# Altium schematic sheet Hardware.SchDoc
size A4; DocumentNumber: 10; SheetNumber: 10; SheetTotal: 11
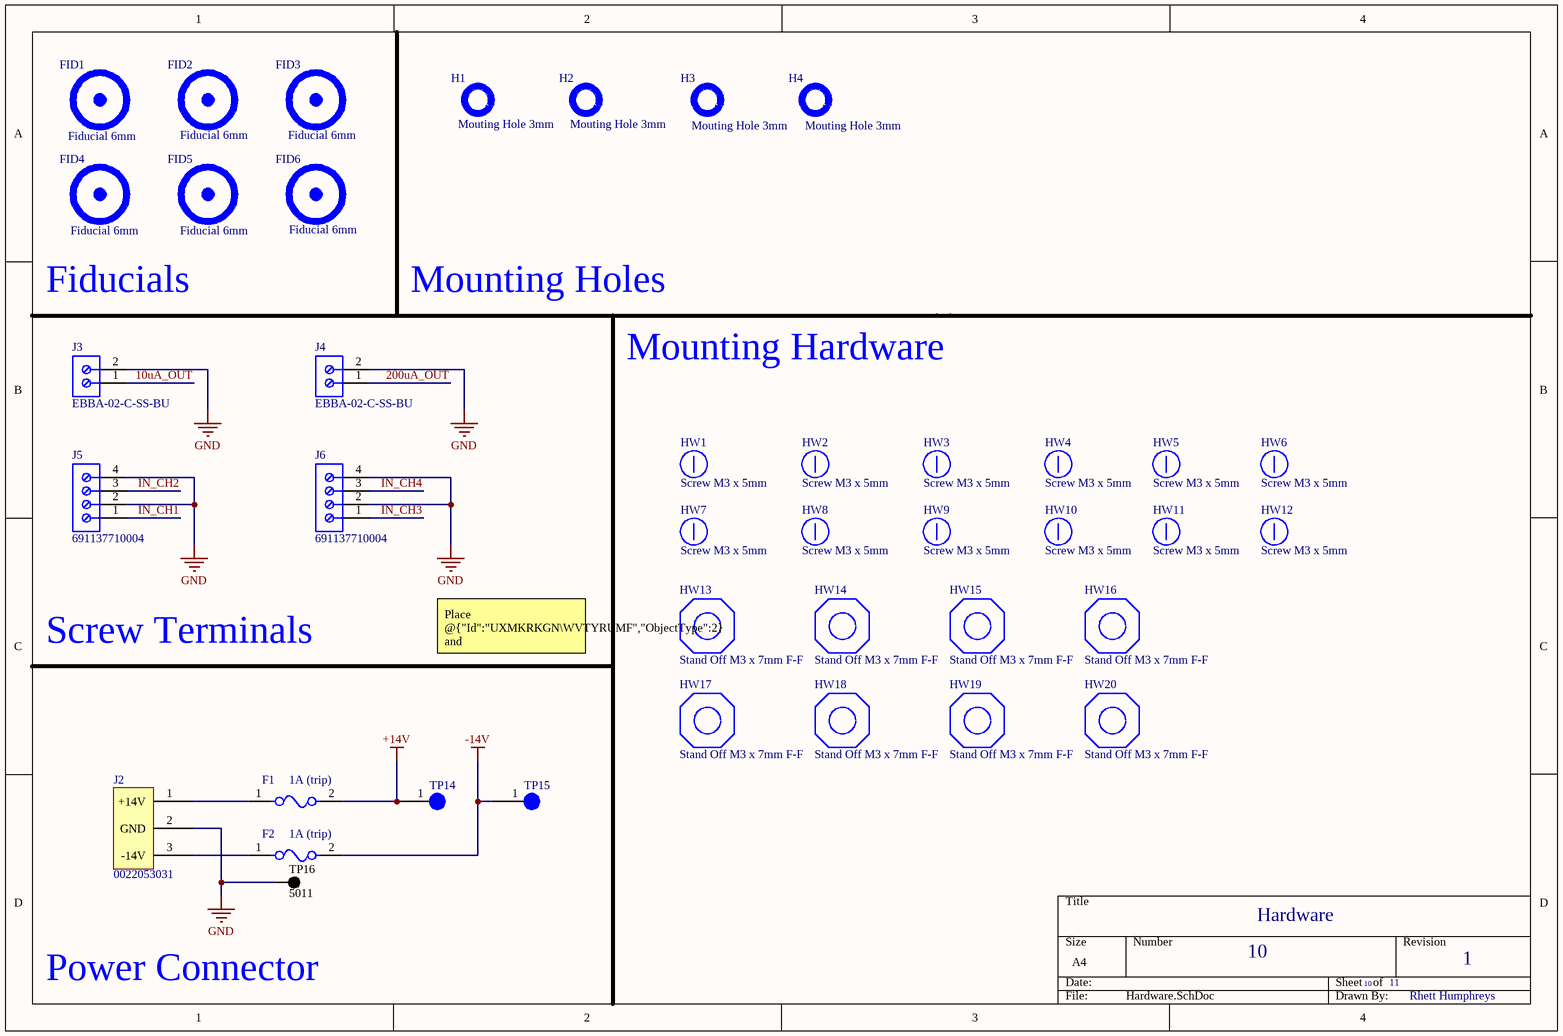
[diagram p0: Hardware.SchDoc]

## Parts
F1  1A (trip)  [FP-0466-MFG]
F2  1A (trip)  [FP-0466-MFG]
FID1  Fiducial 6mm  [Fiducial 6mm]
FID2  Fiducial 6mm  [Fiducial 6mm]
FID3  Fiducial 6mm  [Fiducial 6mm]
FID4  Fiducial 6mm  [Fiducial 6mm]
FID5  Fiducial 6mm  [Fiducial 6mm]
FID6  Fiducial 6mm  [Fiducial 6mm]
H1  Mouting Hole 3mm  [MH3]
H2  Mouting Hole 3mm  [MH3]
H3  Mouting Hole 3mm  [MH3]
H4  Mouting Hole 3mm  [MH3]
HW1  Screw M3 x 5mm
HW2  Screw M3 x 5mm
HW3  Screw M3 x 5mm
HW4  Screw M3 x 5mm
HW5  Screw M3 x 5mm
HW6  Screw M3 x 5mm
HW7  Screw M3 x 5mm
HW8  Screw M3 x 5mm
HW9  Screw M3 x 5mm
HW10  Screw M3 x 5mm
HW11  Screw M3 x 5mm
HW12  Screw M3 x 5mm
HW13  Stand Off M3 x 7mm F-F
HW14  Stand Off M3 x 7mm F-F
HW15  Stand Off M3 x 7mm F-F
HW16  Stand Off M3 x 7mm F-F
HW17  Stand Off M3 x 7mm F-F
HW18  Stand Off M3 x 7mm F-F
HW19  Stand Off M3 x 7mm F-F
HW20  Stand Off M3 x 7mm F-F
J2  0022053031  [0022053031]
J3  EBBA-02-C-SS-BU  [TECO-282836-2_V]
J4  EBBA-02-C-SS-BU  [TECO-282836-2_V]
J5  691137710004  [691137710004]
J6  691137710004  [691137710004]
TP14  Test-Point 3mm  [TestPoint 3mm]  (value not drawn)
TP15  Test-Point 3mm  [TestPoint 3mm]  (value not drawn)
TP16  5011  [KSTN-5011_V]

## Nets
+14V: F1.2 TP14.1
-14V: F2.2 TP15.1
GND: J2.2(GND) J3.2 J4.2 J5.2 J5.4 J6.2 J6.4 TP16.1
10uA_OUT: J3.1
200uA_OUT: J4.1
IN_CH1: J5.1
IN_CH2: J5.3
IN_CH3: J6.1
IN_CH4: J6.3
NetF1_1: F1.1 J2.1(+14V)
NetF2_1: F2.1 J2.3(-14V)

## Notes on the sheet
- Fiducials
- Mounting Holes
- Mounting Hardware
- Screw Terminals
- Place @{"Id":"UXMKRKGN\WVTYRUMF","ObjectType":2} and @{"Id":"UXMKRKGN\KFKNCMDB","ObjectType":2} relatively close to @{"Id":"UXMKRKGN\FYZIDNJZ","ObjectType":2} and @{"Id":"UXMKRKGN\LLHQVDIL","ObjectType":2}.
- Hardware
- Power Connector
- 10
- 11
- 1
- Rhett Humphreys

## Library data of the parts
F1 F2 = CMP-08605-000058-1: FUSE BOARD MNT 1A 63VAC/VDC 1206; Manufacturer Part Number: 0466001.NR; Manufacturer: Littelfuse Inc; Max Fuse Dc Voltage: 63V; Fuse Interrupt Ac Current: 50A; Fuse Voltage Drop: 79.97mV; Resistance: 0.075Ω; Value: 0.075Ω; Fuse I2T: 0.0423A2Sec; Fuse Blow Speed: Fast; Temperature Range High: +90°C; Max Fuse Ac Voltage: 63V; Package: 0466; ComponentLink2URL: https://www.littelfuse.com/~/media/electronics/datasheets/fuses/littelfuse_fuse_466_datasheet.pdf.pdf; Device Class L3: unset; Lead Free: Yes; Automotive: No; Digikey Description: FUSE BOARD MNT 1A 63VAC/VDC 1206; Height: 0.66mm; Temperature Range Low: -55°C; Category: Fuse; ComponentLink2Description: Datasheet; Device Class L1: Circuit Protection; Device Class L2: Fuses; Fuse Current: 1A; Mouser Description: Surface Mount Fuses 63V FA 1206 1A VFA Slimline; Octopart: https://octopart.com/0466001.nr-littelfuse-566005; Fuse Interrupt Dc Current: 50A; RoHS: TRUE; Voltage Rating: 63V; Temperature: -55°C to +90°C
H1-H4 = MH3
HW1-HW12 = Screw M3 x 5mm: Fastener flathead M3 x 5mm
HW13-HW20 = Stand Off M3 x 7mm F-F: Stand off hex M3 x 7mm
J3 J4 = CMP-1684-00017-1: Female Header, Pitch 5 mm, 1 x 2 Position, Height 10 mm, Tail Length 3.5 mm, Rohs, Bulk; Manufacturer: TE Connectivity; Wire Gauge: 16-30AWG; Product Training Modules: Wire-to-BoardEurostyleTerminalBlocks; Clamp Material - Plating: Brass-NickelPlated; Voltage: 300V; Mating Orientation: HorizontalwithBoard; Current: 13.5A; Pitch: 0.197"(5.00mm); Screw Thread: M3; 3D Model: 282836-2.pdf; Other Names: 5ULV-02B / A98076; Dynamic Catalog: BuchananSeries; Number of Levels: 1; Torque - Screw: 0.68Nm(6Lb-In); Featured Product: EurostyleTerminalBlockConnectors; Positions Per Level: 2; Wire Termination: Screw-RisingCageClamp; Datasheet URL: http://www.te.com.cn/commerce/DocumentDelivery/DDEController?Action=showdoc&DocId=Catalog+Section%7F1308389_EUROSTYLE_TERMINAL_BLOCKS%7F0607%7Fpdf%7FEnglish%7FENG_CS_1308389_EUROSTYLE_TERMINAL_BLOCKS_0607.pdf%7F282836-2; Color: Green; Family: TerminalBlocks-WiretoBoard; RoHS Information: 282836-2StatementofCompliance; Standard Package: 300; Contact Material - Plating: Brass-TinPlated; Manufacturer URL: http://www.te.com; Housing Material: Polyamide(PA66),Nylon6/6; Features: Interlocking(Side); Package Description: Female Header, Pitch 5 mm, 1 x 2 Position, Height 10 mm, Tail Length 3.5 mm; Mounting Type: ThroughHole; Package Reference: THD; Packaging: Bulk; Series: Buchanan; Category: Connectors,Interconnects; Screw Material - Plating: Brass-NickelPlated
J5 J6 = CMP-1502-03326-2: NexarPartId: 78871140; Packaging: Box; RoHS: Non-Compliant; Number of Pins: 4; Lead Pitch: 5mm
TP16 = CMP-1672-00003-4: Test Point, Black, Through Hole, RoHS, Bulk; Manufacturer: Keystone; ComponentLink2URL: http://www.keyelco.com/product-pdf.cfm?p=1320; Colour: Black; Pins: 1; REACH SVHC: No SVHC; ComponentLink1URL: http://www.keyelco.com/; PackageReference: 5011; Contact Plating: Silver; Package Quantity: 100; Packaging: Bulk; RoHSCompliant: true; Height: 8.12 mm; PackageDescription: 1-Pin Through Hole Device, Dia 3.17 mm; Mount: Through Hole; Mounting Technology: Through Hole; DatasheetVersion: Rev. F, 12/2013; ComponentLink1Description: Manufacturer URL; Contact Material: Bronze; ComponentLink2Description: Datasheet